# EasyEDA schematic schematic.json

## Sheets
1 Arduino 0.2: TITLE: FAAC 746 Compact; REV: 0.2; Date: 16/06/2021; Sheet: 1/2; Drawn By: Lorenzo Fantazzini; Company: IIS Belluzzi Fioravanti
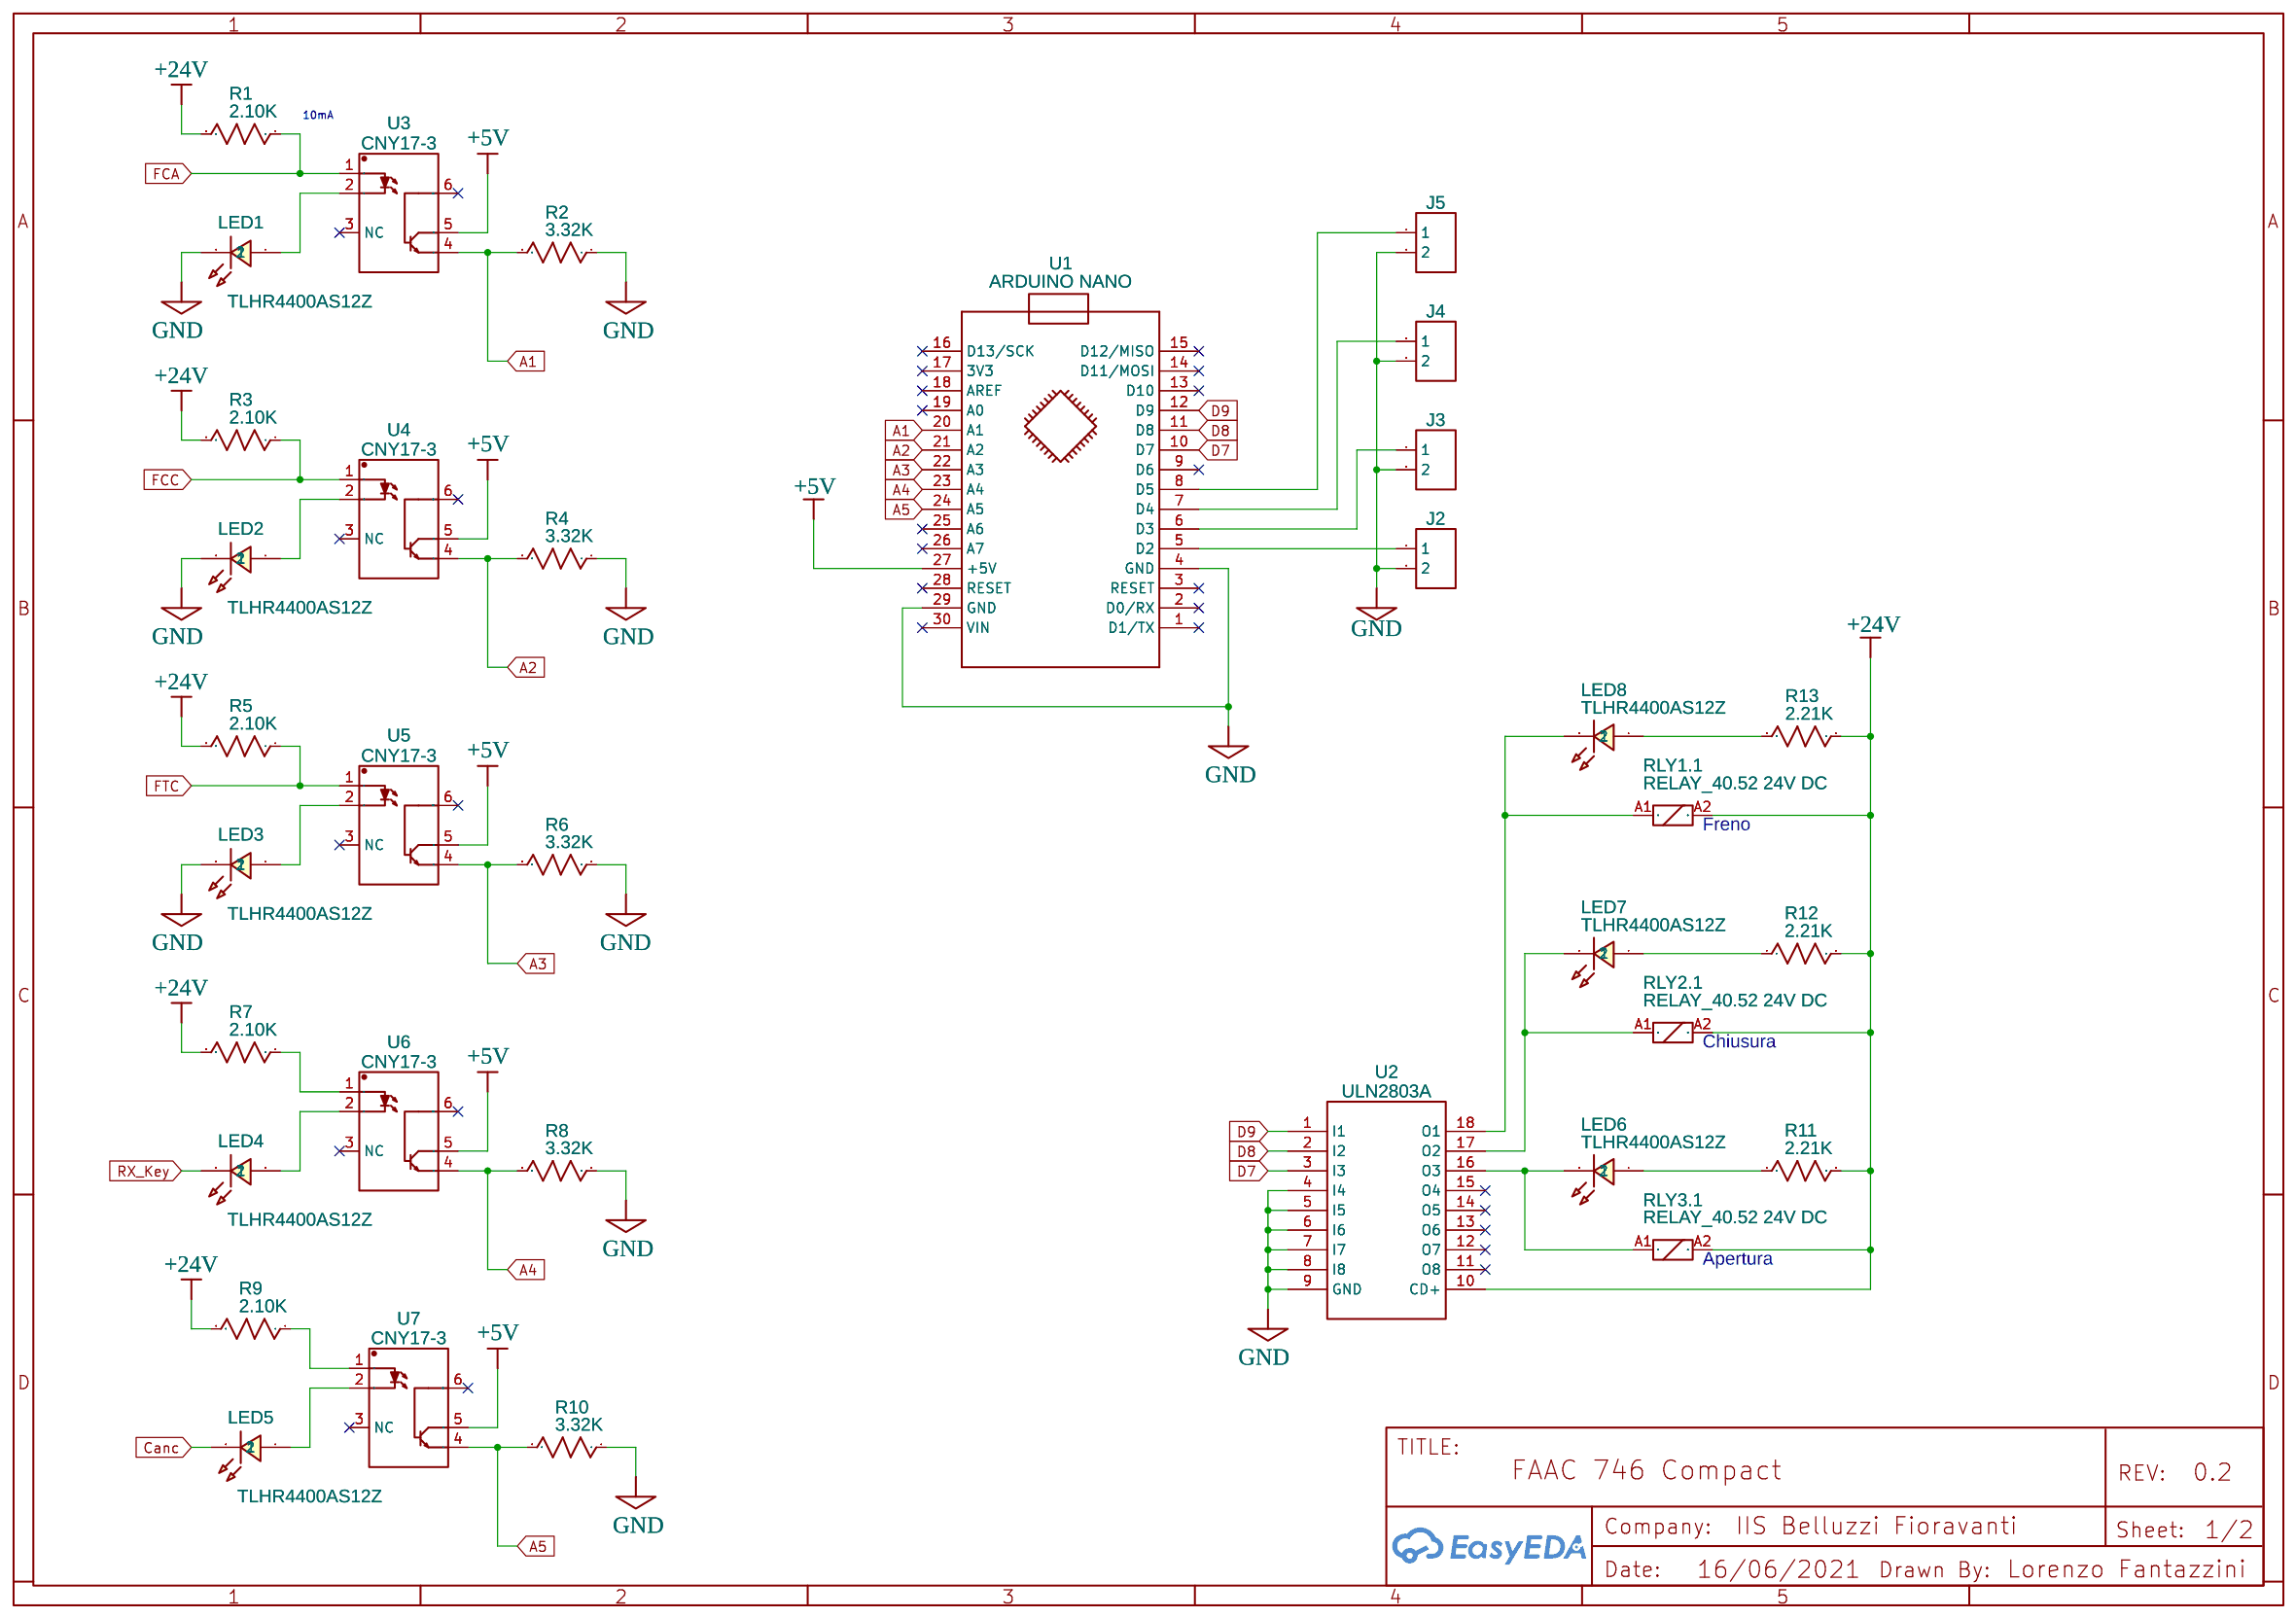
[diagram p0: Arduino 0.2]
2 Potenza 0.2: Sheet: 2/2
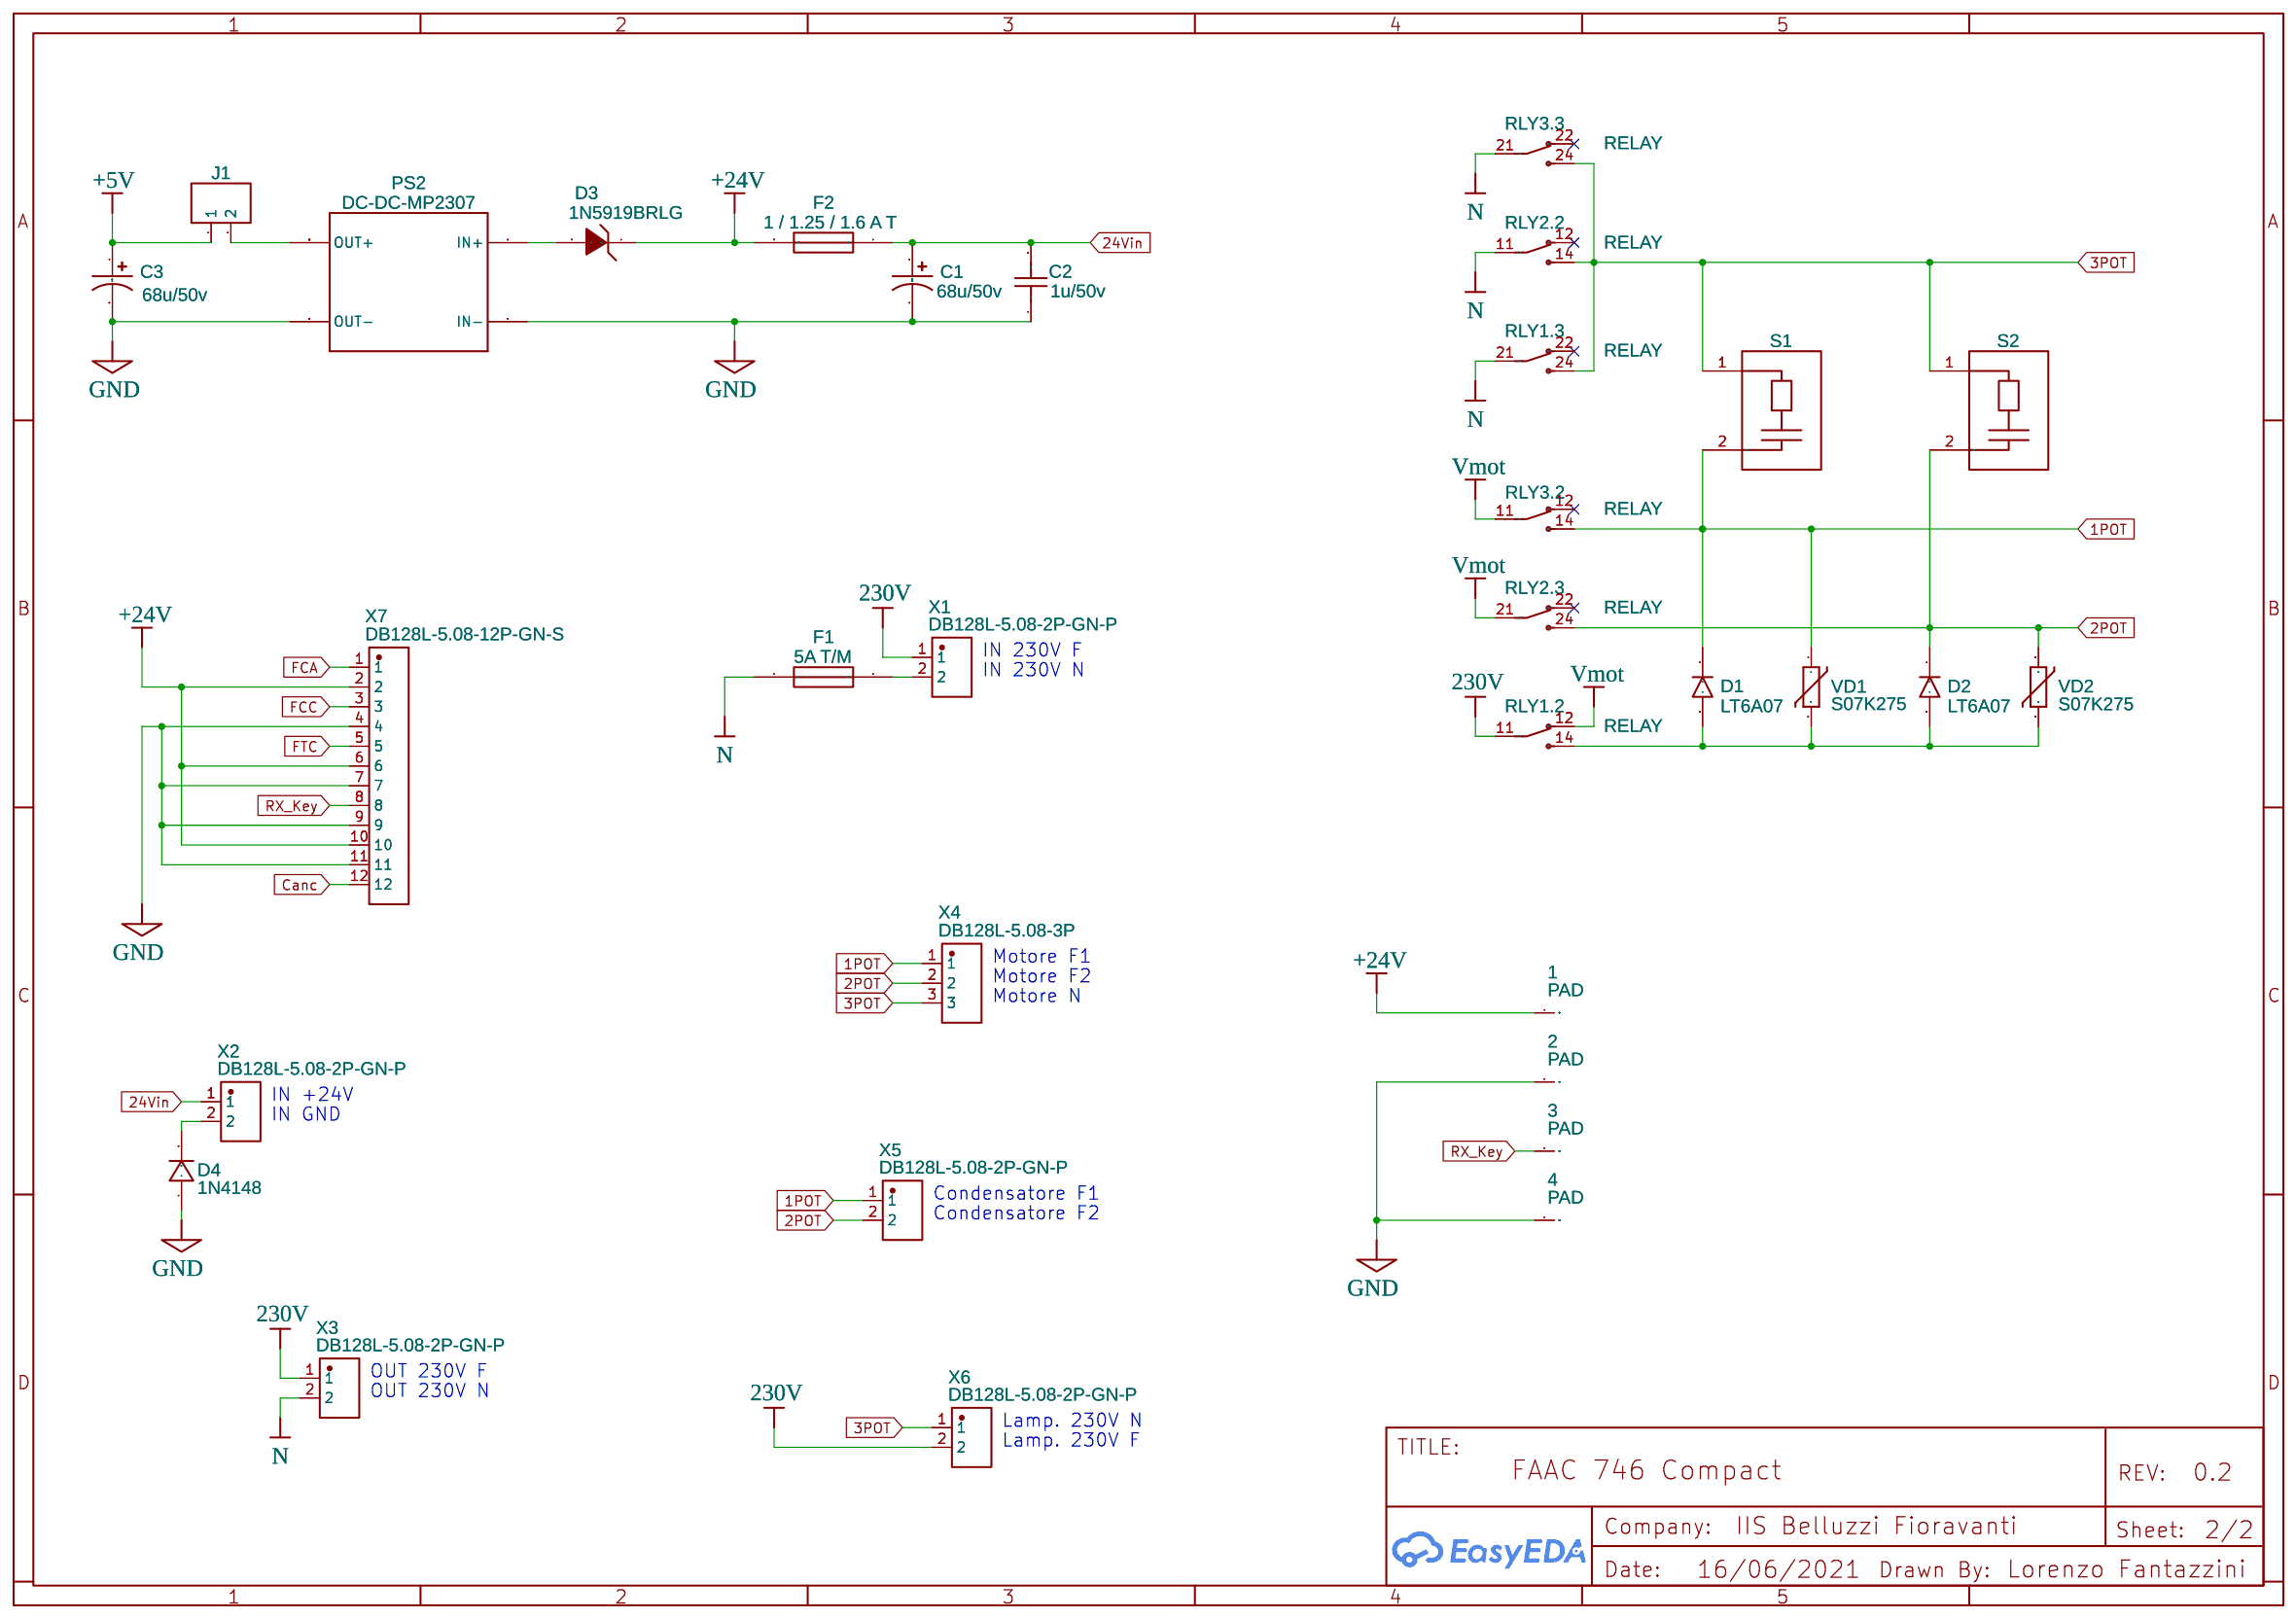
[diagram p1: Potenza 0.2]

## Parts
sheet Arduino 0.2
J2  HDR-M-2.54_1x2  [HDR-M-2.54_1X2]
J3  HDR-M-2.54_1x2  [HDR-M-2.54_1X2]
J4  HDR-M-2.54_1x2  [HDR-M-2.54_1X2]
J5  HDR-M-2.54_1x2  [HDR-M-2.54_1X2]
LED1  TLHR4400AS12Z  [TLHR4400AS12Z]
LED2  TLHR4400AS12Z  [TLHR4400AS12Z]
LED3  TLHR4400AS12Z  [TLHR4400AS12Z]
LED4  TLHR4400AS12Z  [TLHR4400AS12Z]
LED5  TLHR4400AS12Z  [TLHR4400AS12Z]
LED6  TLHR4400AS12Z  [TLHR4400AS12Z]
LED7  TLHR4400AS12Z  [TLHR4400AS12Z]
LED8  TLHR4400AS12Z  [TLHR4400AS12Z]
R1  2.10K  [R_AXIAL-0.5]
R2  3.32K  [R_AXIAL-0.5]
R3  2.10K  [R_AXIAL-0.5]
R4  3.32K  [R_AXIAL-0.5]
R5  2.10K  [R_AXIAL-0.5]
R6  3.32K  [R_AXIAL-0.5]
R7  2.10K  [R_AXIAL-0.5]
R8  3.32K  [R_AXIAL-0.5]
R9  2.10K  [R_AXIAL-0.5]
R10  3.32K  [R_AXIAL-0.5]
R11  2.21K  [R_AXIAL-0.5]
R12  2.21K  [R_AXIAL-0.5]
R13  2.21K  [R_AXIAL-0.5]
RLY1  RELAY_40.52 24V DC  [40.52]  (sections 1,2,3)
RLY2  RELAY_40.52 24V DC  [40.52]  (sections 1,2,3)
RLY3  RELAY_40.52 24V DC  [40.52]  (sections 1,2,3)
U1  ARDUINO NANO  [ARDUINO_NANO]
U2  ULN2803A  [DIP-18_L23.0-W6.5-P2.54-LS7.6-BL]
U3  CNY17-3  [DIP-6_L7.3-W6.5-P2.54-LS7.6-BL]
U4  CNY17-3  [DIP-6_L7.3-W6.5-P2.54-LS7.6-BL]
U5  CNY17-3  [DIP-6_L7.3-W6.5-P2.54-LS7.6-BL]
U6  CNY17-3  [DIP-6_L7.3-W6.5-P2.54-LS7.6-BL]
U7  CNY17-3  [DIP-6_L7.3-W6.5-P2.54-LS7.6-BL]
sheet Potenza 0.2
1  PAD  [18AWG_PAD]
2  PAD  [18AWG_PAD]
3  PAD  [18AWG_PAD]
4  PAD  [18AWG_PAD]
C1  68u/50v  [CAP-D6.3×F2.5]
C2  1u/50v  [RAD-0.2]
C3  68u/50v  [CAP-D6.3×F2.5]
D1  LT6A07  [LT6A07]
D2  LT6A07  [LT6A07]
D3  1N5919BRLG  [DO-41_BD2.4-L4.7-P8.70-D0.9-RD]
D4  1N4148  [DO-35_BD2.0-L4.0-P8.00-D0.5-FD]
F1  5A T/M  [VERTICAL 5X20 FUSEHOLDER]
F2  1 / 1.25 / 1.6 A T  [VERTICAL 5X20 FUSEHOLDER]
J1  HDR-M-2.54_1x2  [HDR-M-2.54_1X2]
PS2  DC-DC-MP2307  [DC-DC-STEP-DOWN-MP2307]
S1  KEMET PMR210  [KEMET PMR210]
S2  KEMET PMR210  [KEMET PMR210]
VD1  S07K275  [S07K275]
VD2  S07K275  [S07K275]
X1  DB128L-5.08-2P-GN-P  [CONN-TH_2P-P5.08_DB128L-5.08-2P-GN-P]
X2  DB128L-5.08-2P-GN-P  [CONN-TH_2P-P5.08_DB128L-5.08-2P-GN-P]
X3  DB128L-5.08-2P-GN-P  [CONN-TH_2P-P5.08_DB128L-5.08-2P-GN-P]
X4  DB128L-5.08-3P  [CONN-TH_DB128L-5.08-3P]
X5  DB128L-5.08-2P-GN-P  [CONN-TH_2P-P5.08_DB128L-5.08-2P-GN-P]
X6  DB128L-5.08-2P-GN-P  [CONN-TH_2P-P5.08_DB128L-5.08-2P-GN-P]
X7  DB128L-5.08-12P-GN-S  [CONN-TH_12P-P5.08_DB128L-5.08-12P-GN-S]

## Library data of the parts
J1-J5 = HDR-M-2.54_1x2: Supplier Part: C124375; Supplier: LCSC; Contributor: LCEDA_Lib
LED1-LED8 = TLHR4400AS12Z: Contributor: Fantazz; link: https://www.mouser.it/datasheet/2/427/tlhg440-1766941.pdf
R1-R13 = R_0603_US: Contributor: LCEDA_Lib
RLY1-RLY3 = RELAY_40.52 24V DC: Contributor: TheNNN747; Manufacturer Part: 40.52.7.024.0000; Supplier: Element14; Supplier Part: 1169174; Manufacturer: Finder; link: http://www.farnell.com/datasheets/2790229.pdf; subpart_no: 1; Package Display: No
U1 = ARDUINO_NANO: sourceId: KGSeAWhDB
U2 = ULN2803APG: Supplier: LCSC; Manufacturer: TOSHIBA; image: //image.lceda.cn/szlcsc/C5252.jpg; Supplier Part: C5252
U3-U7 = CNY17-3: Supplier: LCSC; Manufacturer: LITEON; Supplier Part: C10808; Package Display: No
1-4 = PAD: Contributor: Fantazz
C1 C3 = CE_TH_D6.3×F2.5_US: Contributor: LCEDA_Lib
C2 = C_RAD-0.2_US: Contributor: LCEDA_Lib
D1 D2 = LT6A07: link: https://static6.arrow.com/aropdfconversion/4c14c9d247c1887cde49c37affa19095541be462/download.phphsfilelt6a01lt6a07-4.pdfhdfiletecfile01286519599.pdf; Contributor: Fantazz
D3 = 1N5919BRLG: Supplier: LCSC; Supplier Part: C232465; Manufacturer: ON Semicon; Contributor: LCSC
D4 = 1N4148: Supplier: LCSC; Manufacturer: SEMTECH; Supplier Part: C14516; Contributor: LCEDA_Lib
F1 F2 = 5X20 VERTICAL FUSEHOLDER: Manufacturer: Würth Elektronik; Manufacturer Part: 696309001002; Supplier: Digi-Key; Supplier Part: 732-11383-ND; link: https://www.digikey.com/product-detail/en/w-rth-elektronik/696309001002/732-11383-ND/7244567; Contributor: capshawben
PS2 = DC-DC-STEP-DOWN-MP2307: Contributor: arenda1234
S1 S2 = KEMET PMR210: Contributor: hannesbuntjer_6471
VD1 VD2 = VARISTORS07K275: VARISTOR; Contributor: Pinoccio
X1-X3 X5 X6 = DB128L-5.08-2P-GN-P: Supplier: LCSC; Supplier Part: C430600; Manufacturer: DIBO; Contributor: LCSC; LCSC Assembly: Yes; SMT Type: Extend
X4 = DB128L-5.08-3P: Supplier: LCSC; Supplier Part: C395869; Manufacturer: DIBO; Contributor: LCSC
X7 = DB128L-5.08-12P-GN-S: Supplier: LCSC; Supplier Part: C430608; Manufacturer: DIBO; Contributor: LCSC; LCSC Assembly: Yes; SMT Type: Extend

## Nets
24Vin: C1.1 C2.2 F2.1 X2.1
230V: RLY1.11 X1.1 X3.1 X6.2
+5V: C3.1 J1.1 U1.27(+5V) U3.5(C) U4.5(C) U5.5(C) U6.5(C) U7.5(C)
+24V: 1.1(P$1) D3.1(C) F2.2 R1.2 R3.2 R5.2 R7.2 R9.2 R11.2 R12.2 R13.1 RLY1.A2 RLY2.A2 RLY3.A2 U2.10(CD+) X7.2 X7.6 X7.10
GND: 2.1(P$1) 4.1(P$1) C1.2 C2.1 C3.2 D4.1 J2.2 J3.2 J4.2 J5.2 LED1.2 LED2.2 LED3.2 PS2.IN- PS2.OUT- R2.1 R4.1 R6.1 R8.1 R10.1 U1.4(GND) U1.29(GND) U2.4(I4) U2.5(I5) U2.6(I6) U2.7(I7) U2.8(I8) U2.9(GND) X7.4 X7.7 X7.9 X7.11
1POT: D1.1(K) RLY3.14 S1.2(N) VD1.1 X4.1 X5.1
2POT: D2.1(K) RLY2.24 S2.2(N) VD2.1 X4.2 X5.2
3POT: RLY1.24 RLY2.14 RLY3.24 S1.1(L) S2.1(L) X4.3 X6.1
A1: R2.2 U1.20(A1) U3.4(E)
A2: R4.2 U1.21(A2) U4.4(E)
A3: R6.2 U1.22(A3) U5.4(E)
A4: R8.2 U1.23(A4) U6.4(E)
A5: R10.2 U1.24(A5) U7.4(E)
Canc: LED5.2 X7.12
D7: U1.10(D7) U2.3(I3)
D8: U1.11(D8) U2.2(I2)
D9: U1.12(D9) U2.1(I1)
FCA: R1.1 U3.1 X7.1
FCC: R3.1 U4.1 X7.3
FTC: R5.1 U5.1 X7.5
N: F1.1 RLY1.21 RLY2.11 RLY3.21 X3.2
RX_Key: 3.1(P$1) LED4.2 X7.8
Vmot: RLY1.12 RLY2.21 RLY3.11
Net-(D1-2): D1.2(A) D2.2(A) RLY1.14 VD1.2 VD2.2
Net-(D3-2): D3.2(A) PS2.IN+
Net-(D4-2): D4.2 X2.2
Net-(F1-2): F1.2 X1.2
Net-(J1-2): J1.2 PS2.OUT+
Net-(J2-1): J2.1 U1.5(D2)
Net-(J3-1): J3.1 U1.6(D3)
Net-(J4-1): J4.1 U1.7(D4)
Net-(J5-1): J5.1 U1.8(D5)
Net-(LED1-1): LED1.1 U3.2
Net-(LED2-1): LED2.1 U4.2
Net-(LED3-1): LED3.1 U5.2
Net-(LED4-1): LED4.1 U6.2
Net-(LED5-1): LED5.1 U7.2
Net-(LED6-1): LED6.1 R11.1
Net-(LED6-2): LED6.2 RLY3.A1 U2.16(O3)
Net-(LED7-1): LED7.1 R12.1
Net-(LED7-2): LED7.2 RLY2.A1 U2.17(O2)
Net-(LED8-1): LED8.1 R13.2
Net-(LED8-2): LED8.2 RLY1.A1 U2.18(O1)
Net-(R7-1): R7.1 U6.1
Net-(R9-1): R9.1 U7.1

Not connected (* = marked no-connect by the designer): RLY1 22*; RLY2 12* 22*; RLY3 12* 22*; U1 1(D1/TX)* 2(D0/RX)* 3(RESET)* 9(D6)* 13(D10)* 14(D11/MOSI)* 15(D12/MISO)* 16(D13/SCK)* 17(3V3)* 18(AREF)* 19(A0)* 25(A6)* 26(A7)* 28(RESET)* 30(VIN)*; U2 11(O8)* 12(O7)* 13(O6)* 14(O5)* 15(O4)*; U3 3(NC)* 6(BASE)*; U4 3(NC)* 6(BASE)*; U5 3(NC)* 6(BASE)*; U6 3(NC)* 6(BASE)*; U7 3(NC)* 6(BASE)*

## Notes on the sheets
sheet 1
- 10mA
- Freno
- Chiusura
- Apertura
sheet 2
- IN 230V F
- IN 230V N
- Motore F1
- Motore F2
- Motore N
- IN +24V
- IN GND
- Condensatore F1
- Condensatore F2
- OUT 230V F
- OUT 230V N
- Lamp. 230V N
- Lamp. 230V F
